# EAGLE design flood_sensor (EAGLE 9.5.2)
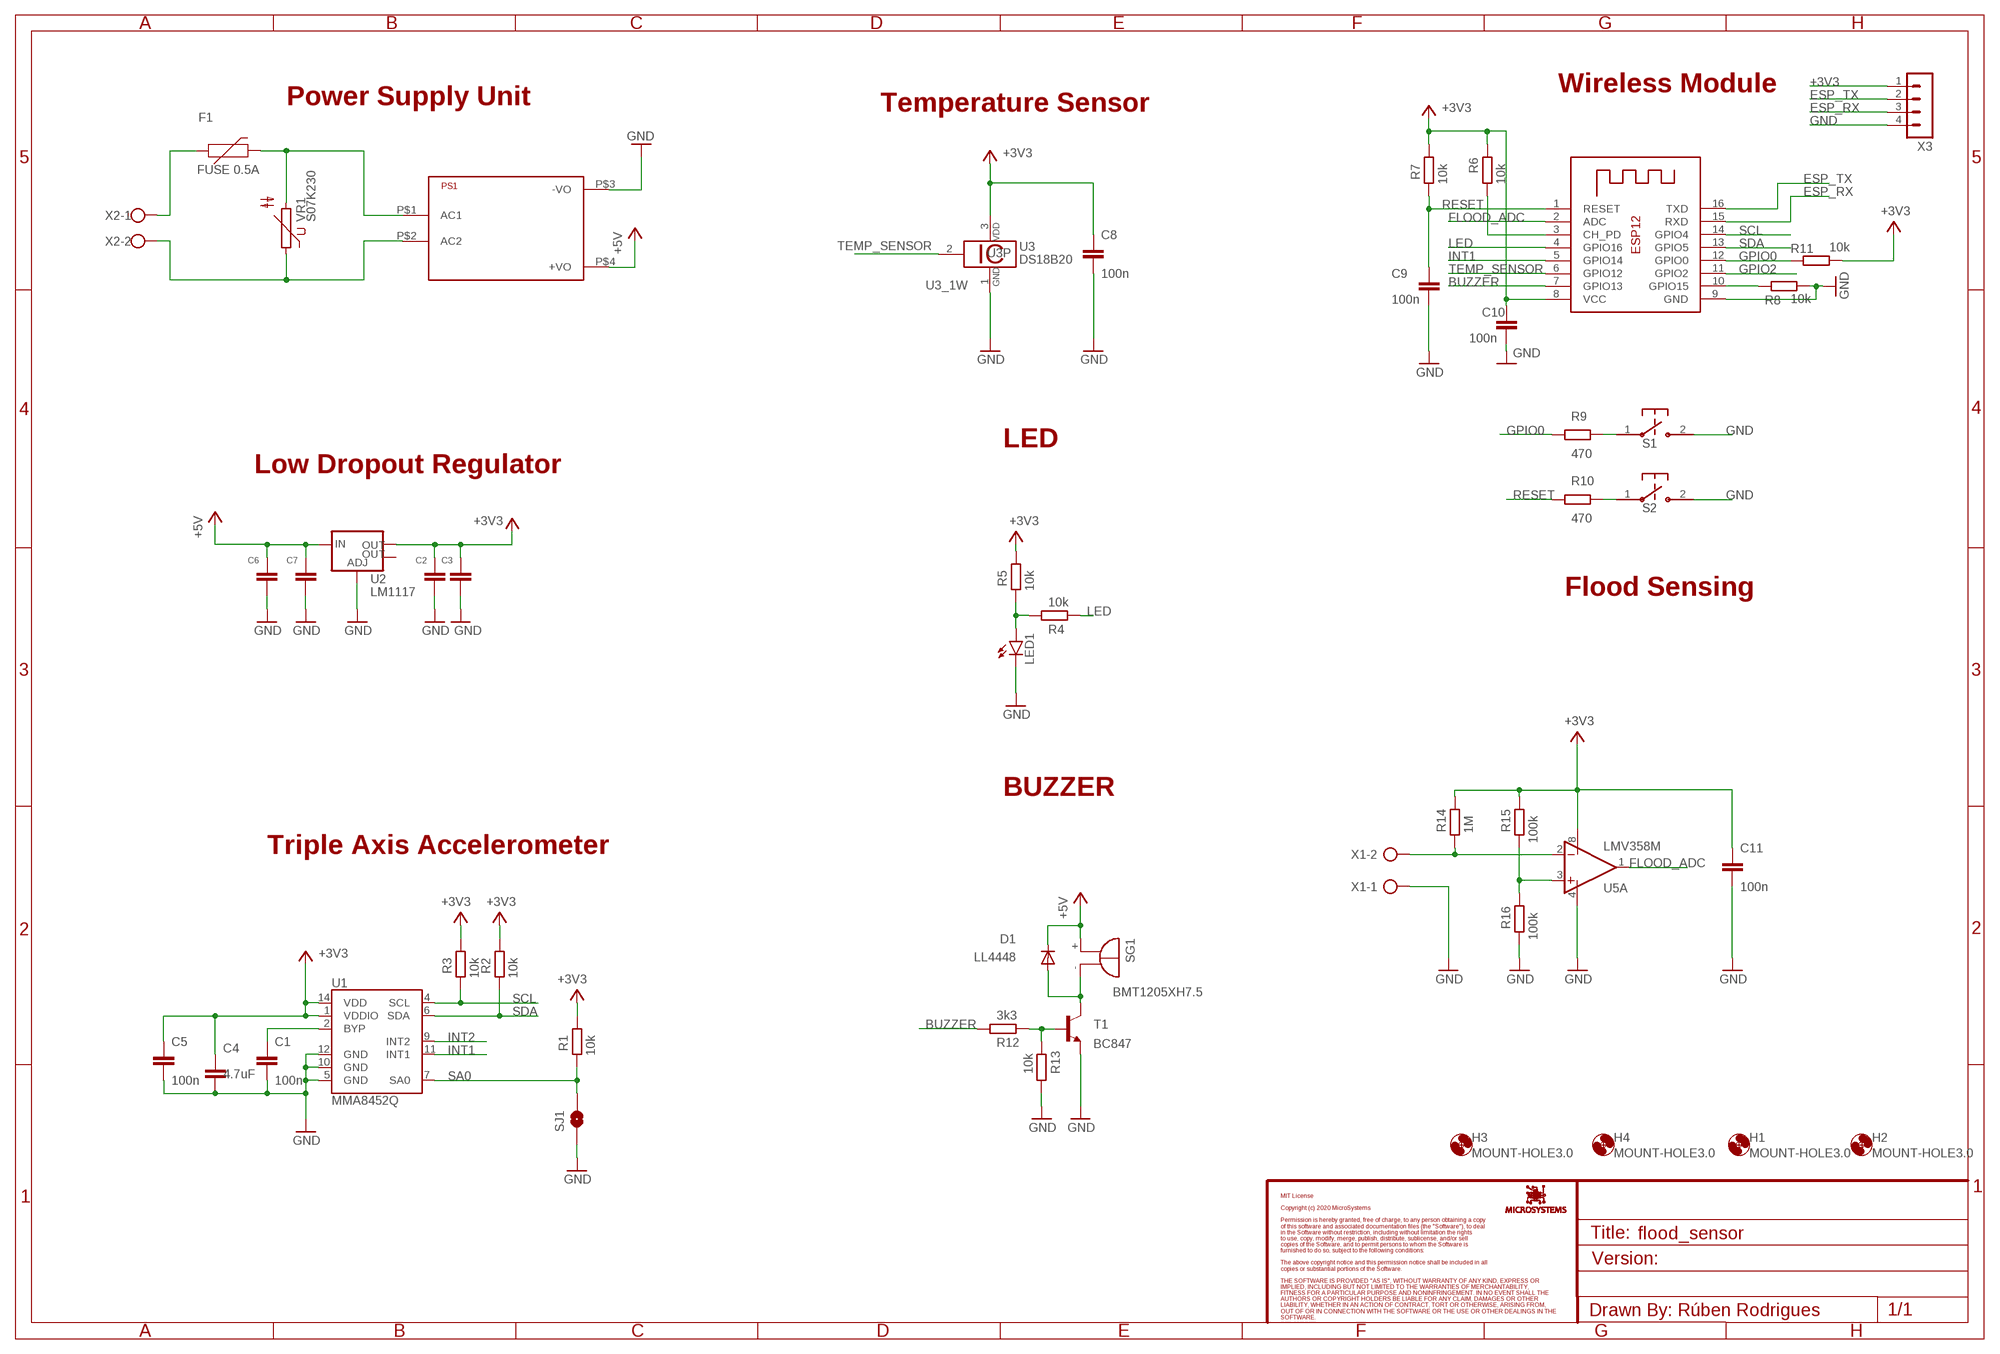
[diagram p0: schematic, sheet 1]

## Parts
C1  100n  C-EUC0805  [C0805]
C2  100uF  C-EUC1206  [C1206]
C3  22uF  C-EUC1206  [C1206]
C4  4.7uF  C-EUC0805  [C0805]
C5  100n  C-EUC0805  [C0805]
C6  22uF  C-EUC1206  [C1206]
C7  100uF  C-EUC1206  [C1206]
C8  100n  C-EUC0805  [C0805]
C9  100n  C-EUC0805  [C0805]
C10  100n  C-EUC0805  [C0805]
C11  100n  C-EUC0805  [C0805]
D1  LL4448  DIODE-SOD80C  [SOD80C]
F1  FUSE 0.5A  PPTC_PTH  [PTH]
H1  MOUNT-HOLE3.0  [3,0]
H2  MOUNT-HOLE3.0  [3,0]
H3  MOUNT-HOLE3.0  [3,0]
H4  MOUNT-HOLE3.0  [3,0]
LED1  LED3MM  [LED3MM]
PS1  HLK-PM013W  [HLK-PM01]
R1  10k  R-EU_R0805  [R0805]
R2  10k  R-EU_R0805  [R0805]
R3  10k  R-EU_R0805  [R0805]
R4  10k  R-EU_R0805  [R0805]
R5  10k  R-EU_R0805  [R0805]
R6  10k  R-EU_R0805  [R0805]
R7  10k  R-EU_R0805  [R0805]
R8  10k  R-EU_R0805  [R0805]
R9  470  R-EU_R0805  [R0805]
R10  470  R-EU_R0805  [R0805]
R11  10k  R-EU_R0805  [R0805]
R12  3k3  R-EU_R0805  [R0805]
R13  10k  R-EU_R0805  [R0805]
R14  1M  R-EU_R0805  [R0805]
R15  100k  R-EU_R0805  [R0805]
R16  100k  R-EU_R0805  [R0805]
S1  SWITCHES_B3U-1000P  [SWITCHES_B3U-1000P]
S2  SWITCHES_B3U-1000P  [SWITCHES_B3U-1000P]
SG1  BMT1205XH7.5  [BMT1205XH7.5]
SJ1  SOLDERJUMPERNO  [SJ_2S-NO]
T1  BC847  [SOT23]
U1  MMA8452Q  [QFN-16_0.5MM]
U2  LM1117  V_REG_LM1117SOT223  [SOT223]
U3  DS18B20  [TO92-]
U4  ESP-12  [ESP-12]
U5  LMV358M  [SO08]
VR1  S07K230  [S07K230]
X1  W237-102  [W237-102]
X2  W237-102  [W237-102]
X3  MA04-1  [MA04-1]

## Nets
+3V3: C2.1 C3.1 C4.1 C5.1 C8.1 C10.1 C11.1 R1.1 R2.1 R3.1 R5.1 R6.1 R7.1 R11.2 R14.1 R15.1 U1.1(VDDIO) U1.14(VDD) U2.2(OUT) U3.3 U4.8(VCC) U5.8(P:V+) X3.1
+5V: C6.1 C7.1 D1.C PS1.P$4(+VO) SG1.+ U2.3(IN)
BUZZER: R12.1 U4.7(GPIO13)
BYP: C1.1 U1.2(BYP)
ESP_RX: U4.15(RXD) X3.3
ESP_TX: U4.16(TXD) X3.2
FLOOD_ADC: U4.2(ADC) U5.1(A:OUT)
GND: C1.2 C2.2 C3.2 C4.2 C5.2 C6.2 C7.2 C8.2 C9.2 C10.2 C11.2 LED1.K(C) PS1.P$3(-VO) R8.2 R13.1 R16.2 S1.2 S2.2 SJ1.1 T1.2(E) U1.5(GND) U1.10(GND) U1.12(GND) U2.1(ADJ) U3.1 U4.9(GND) U5.4(P:V-) X1.1 X3.4
GPIO0: R9.1 R11.1 U4.12(GPIO0)
GPIO2: U4.11(GPIO2)
INT1: U1.11(INT1) U4.5(GPIO14)
INT2: U1.9(INT2)
LED: R4.2 U4.4(GPIO16)
N$1: R8.1 U4.10(GPIO15)
N$2: R15.2 R16.1 U5.3(A:+IN)
N$3: F1.P$1 X2.1
N$4: F1.P$2 PS1.P$1(AC1) VR1.2
N$5: PS1.P$2(AC2) VR1.1 X2.2
N$6: R9.2 S1.1
N$7: LED1.A R4.1 R5.2
N$8: R14.2 U5.2(A:-IN) X1.2
N$9: R10.2 S2.1
N$11: R6.2 U4.3(CH_PD)
N$12: D1.A SG1.- T1.3(C)
N$14: R12.2 R13.2 T1.1(B)
RESET: C9.1 R7.2 R10.1 U4.1(RESET)
SA0: R1.2 SJ1.2 U1.7(SA0)
SCL: R3.2 U1.4(SCL) U4.14(GPIO4)
SDA: R2.2 U1.6(SDA) U4.13(GPIO5)
TEMP_SENSOR: U3.2 U4.6(GPIO12)
Unconnected: U2.4(OUT) U5.5(B:+IN) U5.6(B:-IN) U5.7(B:OUT)

## Notes on the sheet
- Wireless Module
- Power Supply Unit | Temperature Sensor
- LED
- Low Dropout Regulator
- Flood Sensing
- BUZZER
- Triple Axis Accelerometer

## Library data of the parts
C1 C9 C10 = rcl:C-EU: CAPACITOR, European symbol
C2-C8 C11 = rcl:C-EU: CAPACITOR, European symbol; SPICEPREFIX: C
D1 = diode:DIODE-: DIODE
F1 = SparkFun-Fuses:PPTC: Resettable Fuse PPTC Resettable Fuse. Really a sort of resistor with a polymeric positive temperature coefficient whose resistance increases dramatically with an increase in temperature. When heated by the power passing through the resistance rises causing the current to be limited, protecting the circuit. This is achieved by the transition of the polymer from a crystalline to an amorphous state where the conductive carbon separates breaking the conductive pathways found in the cool crystalline structure. When a PPTC cools back down it resumes conducting letting the circuit turn back on. SparkFun Products: SparkFun RedBoard - Programmed with Arduino <https://www.sparkfun.com/products/12757> Pro Micro - 5V/16MHz <https://www.sparkfun.com/products/12640> Arduino Pro 328 - 5V/16MHz <https://www.sparkfun.com/products/10915> MP3 Trigger <https://www.sparkfun.com/products/13720>; PROD_ID: RES-08490; SERIE: 392; VALUE: 72V/0.25A
H1-H4 = holes:MOUNT-HOLE: MOUNTING HOLE with drill center marker
LED1 = led:LED: LED OSRAM: - CHIPLED LG R971, LG N971, LY N971, LG Q971, LY Q971, LO R971, LY R971 LH N974, LH R974 LS Q976, LO Q976, LY Q976 LO Q996 - Hyper CHIPLED LW Q18S LB Q993, LB Q99A, LB R99A - SideLED LS A670, LO A670, LY A670, LG A670, LP A670 LB A673, LV A673, LT A673, LW A673 LH A674 LY A675 LS A676, LA A676, LO A676, LY A676, LW A676 LS A679, LY A679, LG A679 - Hyper Micro SIDELED® LS Y876, LA Y876, LO Y876, LY Y876 LT Y87S - SmartLED LW L88C, LW L88S LB L89C, LB L89S, LG L890 LS L89K, LO L89K, LY L89K LS L896, LA L896, LO L896, LY L896 - TOPLED LS T670, LO T670, LY T670, LG T670, LP T670 LSG T670, LSP T670, LSY T670, LOP T670, LYG T670 LG T671, LOG T671, LSG T671 LB T673, LV T673, LT T673, LW T673 LH T674 LS T676, LA T676, LO T676, LY T676, LB T676, LH T676, LSB T676, LW T676 LB T67C, LV T67C, LT T67C, LS T67K, LO T67K, LY T67K, LW E67C LS E67B, LA E67B, LO E67B, LY E67B, LB E67C, LV E67C, LT E67C LW T67C LS T679, LY T679, LG T679 LS T770, LO T770, LY T770, LG T770, LP T770 LB T773, LV T773, LT T773, LW T773 LH T774 LS E675, LA E675, LY E675, LS T675 LS T776, LA T776, LO T776, LY T776, LB T776 LHGB T686 LT T68C, LB T68C - Hyper Mini TOPLED® LB M676 - Mini TOPLED Santana® LG M470 LS M47K, LO M47K, LY M47K Source: http://www.osram.convergy.de LUXEON: - LUMILED® LXK2-PW12-R00, LXK2-PW12-S00, LXK2-PW14-U00, LXK2-PW14-V00 LXK2-PM12-R00, LXK2-PM12-S00, LXK2-PM14-U00 LXK2-PE12-Q00, LXK2-PE12-R00, LXK2-PE12-S00, LXK2-PE14-T00, LXK2-PE14-U00 LXK2-PB12-K00, LXK2-PB12-L00, LXK2-PB12-M00, LXK2-PB14-N00, LXK2-PB14-P00, LXK2-PB14-Q00 LXK2-PR12-L00, LXK2-PR12-M00, LXK2-PR14-Q00, LXK2-PR14-R00 LXK2-PD12-Q00, LXK2-PD12-R00, LXK2-PD12-S00 LXK2-PH12-R00, LXK2-PH12-S00 LXK2-PL12-P00, LXK2-PL12-Q00, LXK2-PL12-R00 Source: www.luxeon.com KINGBRIGHT: KA-3528ASYC Source: www.kingbright.com
PS1 = ruben:HLK-PM01: Hi-Link Power Supply HLK-PM01 3W Author: Ahmed Said <https://github.com/AhmedSaid/EAGLELibraries>
R1-R16 = rcl:R-EU_: RESISTOR, European symbol; SPICEPREFIX: R
S1 S2 = ruben:SWITCHES_B3U: Switch; DIGIKEY: SW1020CT-ND; MANUFACTURER: Omron; MPN: B3U-1000P
SG1 = buzzer:BMT1205XH7.5: MAGNETIC TRANSDUCER Source: Http:www.be-star.com; OC_FARNELL: unknown; OC_NEWARK: unknown
SJ1 = SparkFun:SOLDERJUMPER: Solder Jumper Standard SMD solder jumper. Used to automate production. Two varients : Normally Open and Normally Closed are the same, but have different paste layers. NC will have a large amount of paste and should jumper during reflow.
T1 = transistor-neu-to92:BC847: NPN TRANSISTOR
U1 = ruben:MMA8452Q: MMA8452Q 3-Axis, 12/8-bit Digital Accelerometer Supply Voltage: 1.6-3.6V Range: +/- 2g, 4g, 8g Interface: I2C, 12-bit and 8-bit ODR: 1.56 Hz - 800 Hz Package: QFN-16 http://cache.freescale.com/files/sensors/doc/data_sheet/MMA8452Q.pdf
U2 = SparkFun-IC-Power:V_REG_LM1117: Voltage Regulator LM1117 Standard adjustable voltage regulator but in SMD form. Spark Fun Electronics SKU : COM-00595; PROD_ID: VREG-08170
U3 = 1wire:DS18B20: Programmable Resolution Digital Thermometer This chip provides a onewire thermosensor with approx. 0.5°C accuracy. A programmable over/undertemperure alarm is available. The precision can be set from 9..12 bits. Notes: Vdd must be applied for accurate measurements at low temperatures, as the parasite power circuit otherwise heats the sensor. If parasite power is used, Vdd has to be connected to GND. The DS1822 is a low-cost thermometer chip, the DS18S20 is similar to the DS18B20, but with 9 Bit precision only. Author: Jan Kandziora <jjj@gmx.de>
U4 = adafruit:ESP-12
U5 = linear:LMV358?*: Dual General Purpose, Low Voltage, Rail-to-Rail Output Operational Amplifiers Source: http://www.national.com/mpf/LM/LMV321.html http://www.national.com/dt/lmv_qual.pdf
VR1 = varistor:S07K230: VARISTOR
X1 X2 = con-wago-500:W237-102: WAGO SCREW CLAMP; MPN: 237-102; OC_FARNELL: unknown; OC_NEWARK: 70K9898
X3 = con-lstb:MA04-1: PIN HEADER; OC_FARNELL: unknown; OC_NEWARK: unknown

## Board
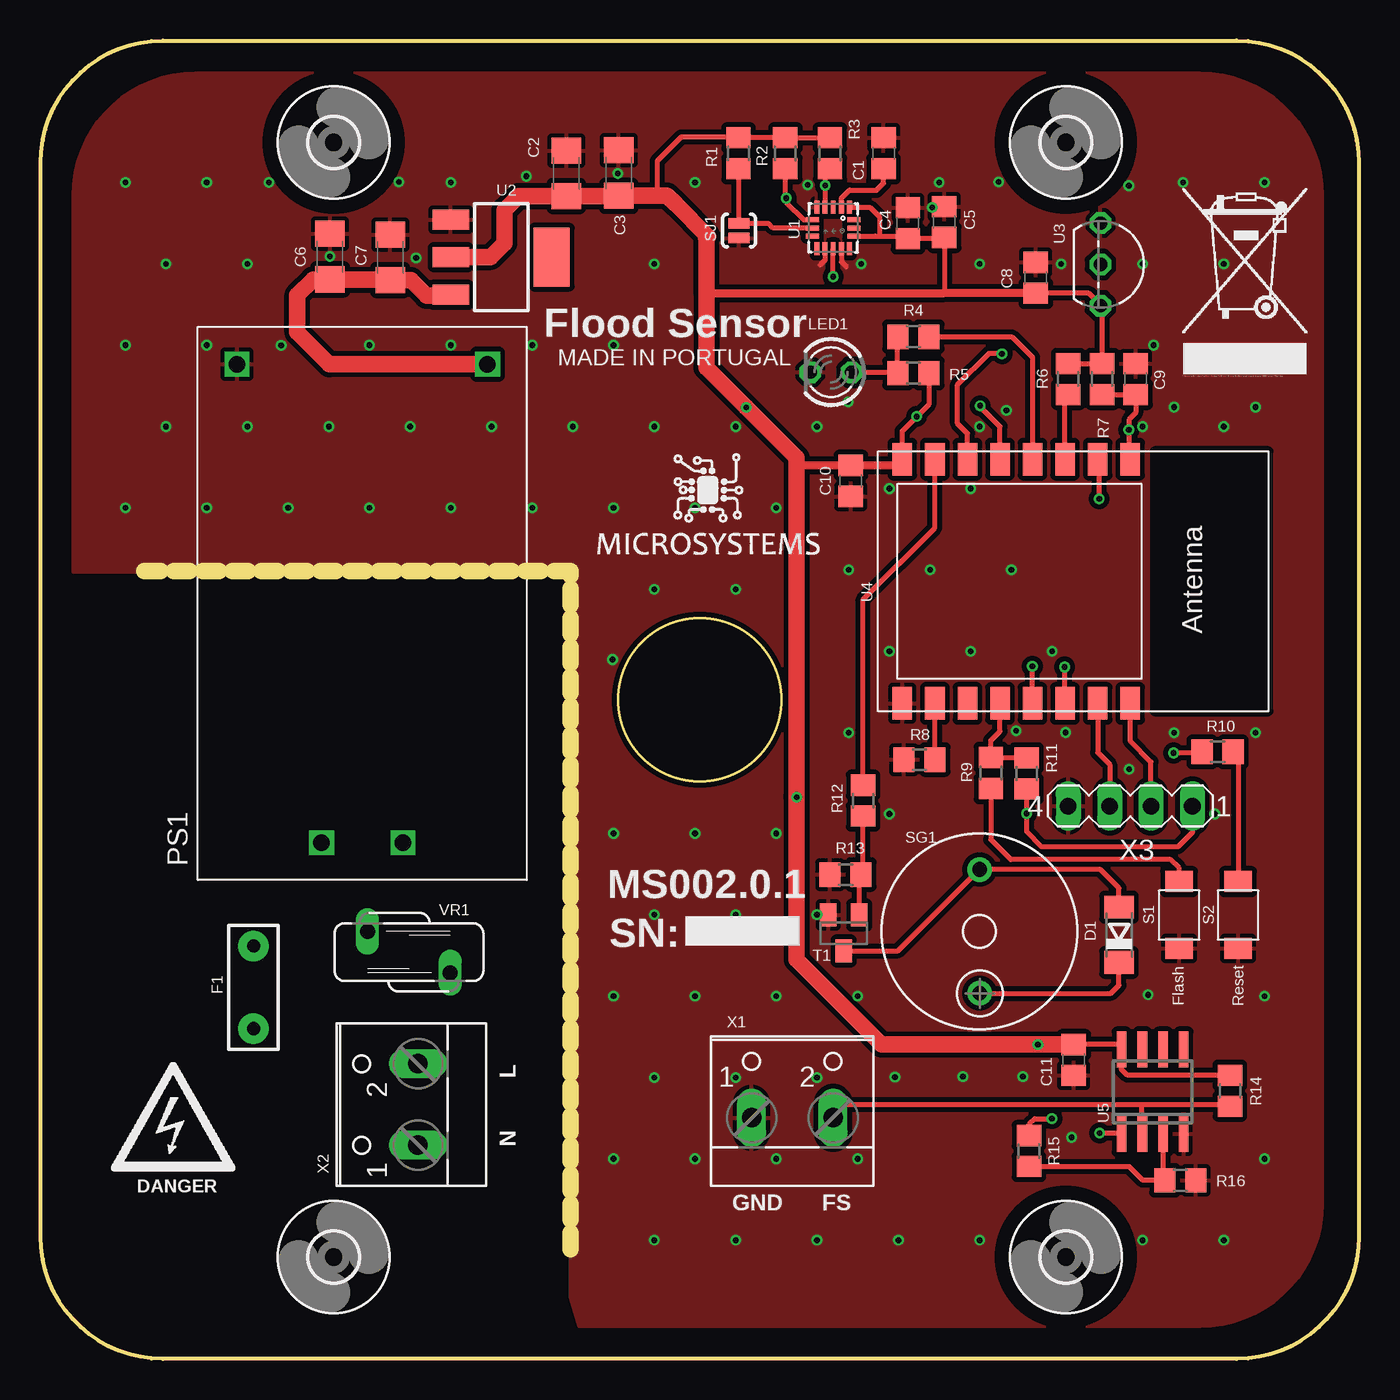
[diagram p1: board, top side]
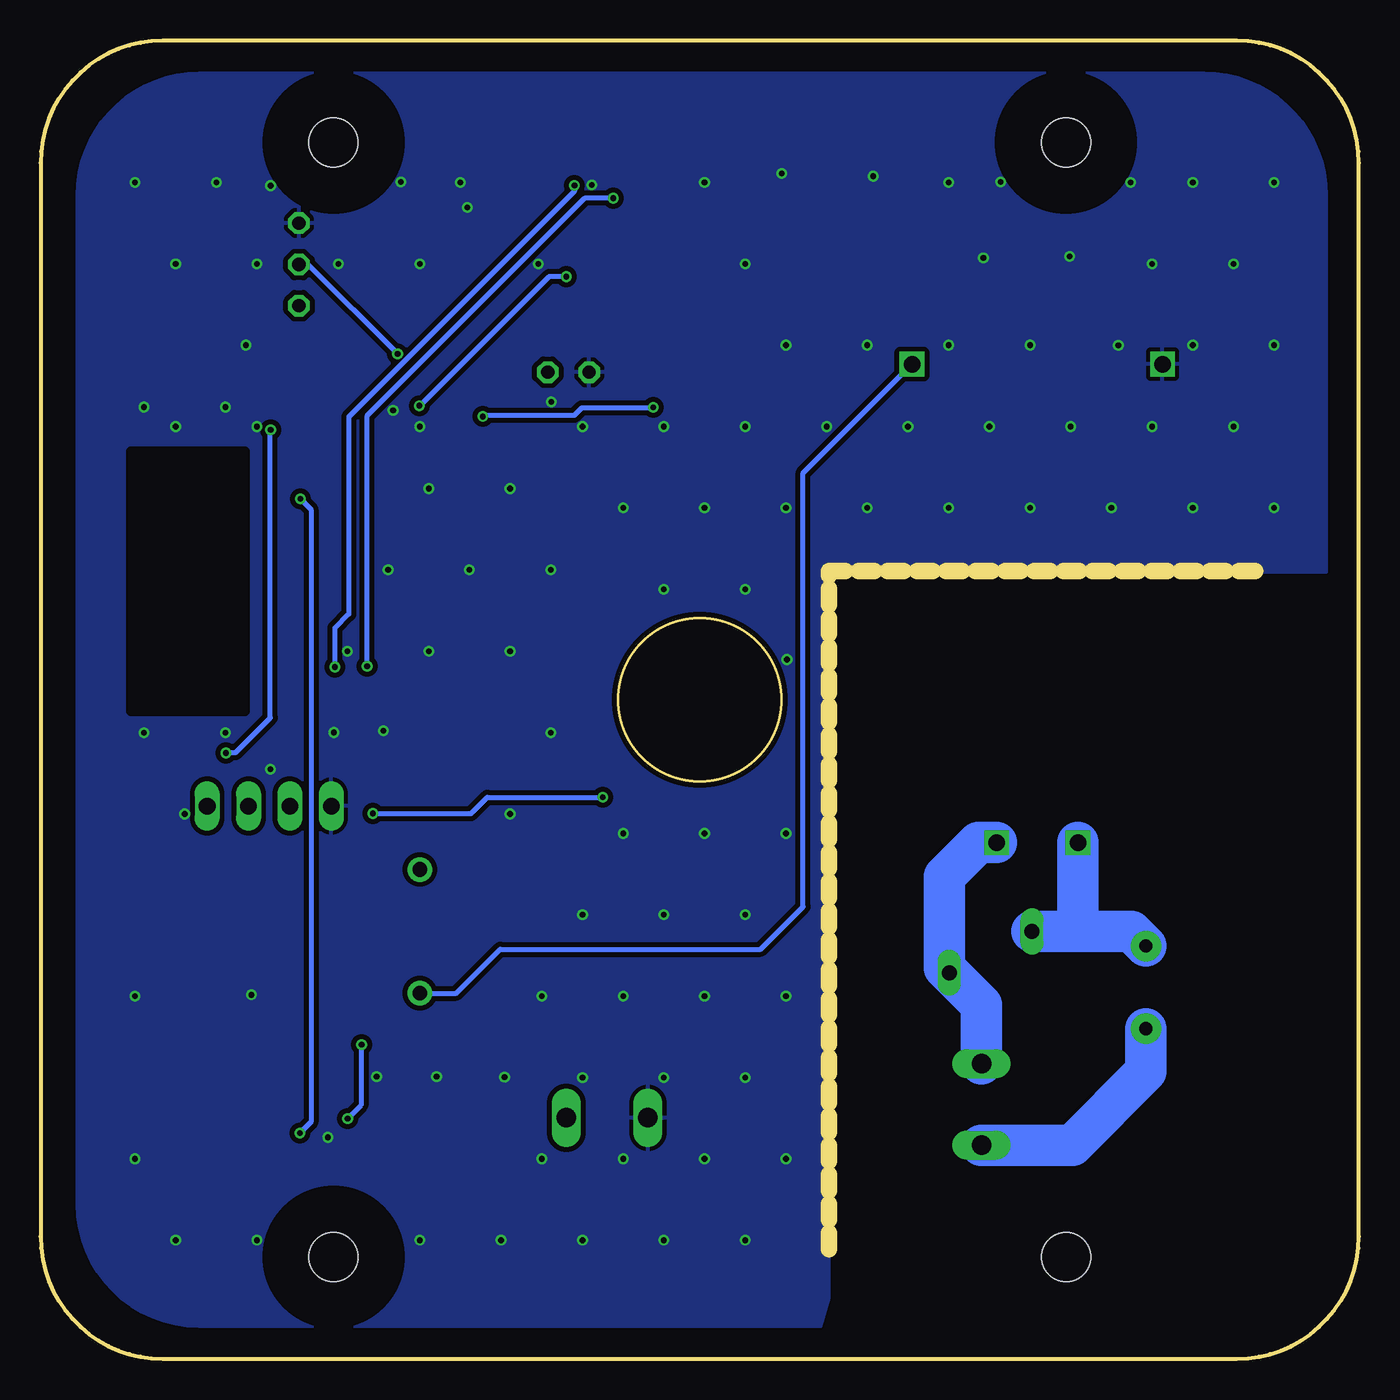
[diagram p2: board, bottom side, seen from below]

Size 81 x 81 mm. Coordinates in mm from the lower left corner, seen from the top.
Outline: 73.5,0 7.5,0 arc-90 0,7.5 0,73.5 arc-90 7.5,81 73.5,81 arc-90 81,73.5 81,7.5 arc-90 73.5,0
Outline: circle at 40.5,40.5 radius 5
Copper layers (1*16): Top 0.035mm / dielectric 1.5mm / Bottom 0.035mm
Design rules "SeeedStudio_2layer_DRU_no_angle_20140221 *": minimum track width 6mil, minimum drill 12mil, track to track 6mil, track to pad 6mil, pad to pad 6mil, via to via 6mil, smd to smd 0mil, copper to edge 10mil, drill to drill 10mil, minimum pad ring 10mil, minimum via ring 6mil, stop-mask expansion 2mil, vias tented up to drill 100mil, thermal gap 10mil
Milling: 39 lines

### Footprints (pad centres in the part's own frame; a part is rotated, then mirrored left to right if it is on the bottom)
C0805 = smd 1.3 x 1.5: 1 -0.95,0; 2 0.95,0
C1206 = smd 1.6 x 1.8: 1 -1.4,0; 2 1.4,0
SOD80C = smd 1.4 x 1.8: A 1.7,0; C -1.7,0
PTH = drill 0.8 pad 1.88: P$1 -2.54,0; P$2 2.54,0
3,0 = hole 3: 0,0
LED3MM = drill 0.813 octagon: A -1.27,0; K 1.27,0
HLK-PM01 = drill 1.016 square: P$1 -14.7,2.5; P$2 -14.7,-2.5; P$3 14.7,7.7; P$4 14.7,-7.7
R0805 = smd 1.3 x 1.5: 1 -0.95,0; 2 0.95,0
SWITCHES_B3U-1000P = smd 1.283 x 1.7: 1 -2.056,0; 2 2.056,0
BMT1205XH7.5 = drill 0.9 pad 1.5: + 3.8,0; - -3.8,0
SJ_2S-NO = smd 0.635 x 1.27: 1 -0.45,0; 2 0.45,0
SOT23 = smd 1 x 1.4: 1 -0.95,-1.1; 2 0.95,-1.1; 3 0,1.1
QFN-16_0.5MM = smd 0.8 x 0.3: 1 -1.275,1; 2 -1.275,0.5; 3 -1.275,0; 4 -1.275,-0.5; 5 -1.275,-1; 9 1.275,-1; 10 1.275,-0.5; 11 1.275,0; 12 1.275,0.5; 13 1.275,1 | smd 0.3 x 0.8: 6 -0.5,-1.275; 7 0,-1.275; 8 0.5,-1.275; 14 0.5,1.275; 15 0,1.275; 16 -0.5,1.275
SOT223 = smd 1.219 x 2.235: 1 -2.311,-3.099; 2 0,-3.099; 3 2.311,-3.099 | smd 3.6 x 2.2: 4 0,3.099
TO92- = drill 0.813 octagon: 1 -2.54,0; 2 0,0; 3 2.54,0
ESP-12 = smd 2 x 1.2: 1 -7.5,4.5; 2 -7.5,2.5; 3 -7.5,0.5; 4 -7.5,-1.5; 5 -7.5,-3.5; 6 -7.5,-5.5; 7 -7.5,-7.5; 8 -7.5,-9.5; 9 7.5,-9.5; 10 7.5,-7.5; 11 7.5,-5.5; 12 7.5,-3.5; 13 7.5,-1.5; 14 7.5,0.5; 15 7.5,2.5; 16 7.5,4.5
SO08 = smd 0.6 x 2.2: 1 -1.905,-2.6; 2 -0.635,-2.6; 3 0.635,-2.6; 4 1.905,-2.6; 5 1.905,2.6; 6 0.635,2.6; 7 -0.635,2.6; 8 -1.905,2.6
S07K230 = drill 0.914 long: 1 -1.27,-2.54; 2 1.27,2.54
W237-102 = drill 1.194 long: 1 -2.5,-1.27; 2 2.5,-1.27
MA04-1 = drill 1.016 long: 1 -3.81,0; 2 -1.27,0; 3 1.27,0; 4 3.81,0

### Placement (x,y rotation side)
C1  51.79,74.08 90 top
C2  32.3,72.85 90 top
C3  35.52,72.87 90 top
C4  53.29,69.78 90 top
C5  55.53,69.86 90 top
C6  17.78,67.73 90 top
C7  21.48,67.69 90 top
C8  61.15,66.43 90 top
C9  67.29,60.21 90 top
C10  49.78,53.95 270 top
C11  63.48,18.36 270 top
D1  66.26,26.06 90 top
F1  13.08,22.83 90 top
H1  18,74.75 0 top
H2  63,74.75 0 top
H3  18,6.25 0 top
H4  63,6.25 0 top
LED1  48.57,60.63 180 top
PS1  19.76,46.42 90 top
R1  42.88,74.08 270 top
R2  45.76,74.08 270 top
R3  48.5,74.08 270 top
R4  53.63,62.81 0 top
R5  53.63,60.57 180 top
R6  63.14,60.21 270 top
R7  65.23,60.21 270 top
R8  54,36.82 180 top
R9  58.39,36 270 top
R10  72.32,37.3 0 top
R11  60.58,35.97 270 top
R12  50.54,34.3 270 top
R13  49.46,29.76 0 top
R14  73.08,16.47 270 top
R15  60.73,12.77 270 top
R16  70.03,10.97 0 top
S1  69.96,27.27 270 top
S2  73.58,27.27 270 top
SG1  57.69,26.27 270 top
SJ1  42.91,69.33 90 top
T1  49.35,26.17 180 top
U1  48.7,69.49 270 top
U2  28.3,67.7 270 top
U3  65.13,67.25 270 top
U4  62.45,47.78 270 top
U5  68.33,16.41 0 top
U$1  [DISPOSAL]  70.16,60.54 0 top
U$2  [LOGO]  40.8,51.5 0 top
U$3  [HIGH-VOLTAGE]  4.35,11.08 0 top
VR1  22.63,24.99 90 top
X1  46.19,16.08 0 top
X2  21.92,15.63 90 top
X3  66.96,33.97 180 top

### Tracks (layer width: path | path; a pad name or v marks a point on that pad's centre or on a via)
+3V3  (via drill 0.35)
  Top 0.152: U5.8 66.24,19.19 66.24,19.31
  Top 0.3: 66.24,19.31 C11.1 | R14.1 66.78,17.42 66.41,17.79 U5.8 | R15.1 60.73,14.4 61.09,14.76 v62.14,14.76 | C8.1 64.4,65.48 64.99,64.89 64.99,64.85 U3.3 65.23,64.61 R7.1 R6.1 | 40.89,68.86 41,68.97 | U1.14 51.29,68.99 51.53,68.99 51.53,70.18 50.95,70.77 U1.1 | 37.88,73.6 39.36,75.08 42.83,75.08 R1.1 R2.1 R3.1 | U4.8 52.95,57.02 v53.84,57.91 54.58,58.65 R5.1 | 46.45,55.25 46.45,55.38 | R11.2 v60.58,33.52 v60.59,33.51 60.59,32.4 61.52,31.47 69.88,31.47 70.77,32.36 X3.1 | C5.1 55.53,65.51 55.52,65.5
  Top 0.305: 37.88,73.6 37.88,71.6 38.01,71.47 | 51.29,68.99 53.13,68.99 C4.1 55.45,68.83 C5.1
  Top 0.5: 40.91,65.5 55.52,65.5 61.13,65.5 C8.1 | U4.8 52.56,54.89 C10.1 46.78,54.9 46.44,55.24
  Top 1: U2.2 27.65,67.7 28.5,68.55 28.5,70.59 | C11.1 v61.28,19.31 51.67,19.31 46.45,24.53 v46.45,34.52 v46.44,34.53 46.44,55.24 46.45,55.25 | 46.45,55.38 v43.35,58.48 40.91,60.92 40.91,65.5 40.91,68.84 40.89,68.86 | 35.64,71.59 C3.1 | 39.03,70.94 41,68.97
  Top 1.016: 28.5,70.59 29.36,71.45 C2.1 35.5,71.45 35.64,71.59 | C3.1 38.01,71.47 38.5,71.47 39.03,70.94
  Bottom 0.3: v62.14,14.76 61.31,15.59 61.31,19.28 v61.28,19.31 | v60.59,33.51 54.55,33.51 53.57,34.5 46.47,34.5 v46.45,34.52 | v43.35,58.48 43.38,58.45 47.74,58.45 48.2,57.99 53.75,57.99 v53.84,57.91
+5V
  Top 0.3: SG1.+ 65.77,22.47 66.26,22.96 D1.C
  Top 1: PS1.P$4 17.73,61.12 15.76,63.09 15.76,65.36 16.73,66.33 C6.1 21.44,66.33 C7.1 22.75,66.29 23.71,65.33 25.14,65.33 U2.3
  Bottom 0.3: SG1.+ 55.46,22.47 52.77,25.16 36.76,25.16 34.15,27.77 34.15,54.43 PS1.P$4
BUZZER
  Top 0.3: R12.1 50.54,46.65 54.95,51.06 U4.7
BYP
  Top 0.3: U1.2 49.2,71.31 49.71,71.82 51.36,71.82 51.37,71.81 51.8,72.24 C1.1
ESP_RX
  Top 0.3: U4.15 64.95,37.25 65.69,36.51 X3.3
ESP_TX
  Top 0.3: X3.2 68.23,36.69 66.95,37.97 U4.16
FLOOD_ADC  (via drill 0.35)
  Top 0.3: v65.08,13.87 65.14,13.87 65.15,13.86 66.38,13.86 U5.1 | v65.05,52.85 65.05,55.18 U4.2
  Bottom 0.3: v65.05,52.85 64.39,52.19 64.39,14.56 v65.08,13.87
GND  (via drill 0.35)
  Top 0.3: U1.10 48.2,67.52 47.91,67.23 | U1.12 49.2,67.41 49.51,67.1
  other vias: 5.21,52.29 7.71,57.29 5.21,62.29 7.71,67.29 5.21,72.29 10.21,52.29 12.71,57.29 10.21,62.29 12.71,67.29 10.21,72.29 15.21,52.29 17.71,57.29 14.78,62.28 17.78,67.75 14.02,72.29 20.21,52.29 22.71,57.29 20.21,62.29 23.07,67.65 22.02,72.32 25.21,52.29 27.71,57.29 25.21,62.29 25.21,72.29 30.21,52.29 32.71,57.29 30.21,62.29 29.85,72.67 37.71,7.29 35.21,12.29 37.71,17.29 35.21,22.29 37.71,27.29 35.21,32.29 35.15,42.97 37.71,47.29 35.21,52.29 37.71,57.29 35.21,62.29 37.71,67.29 35.47,72.84 42.71,7.29 40.21,12.29 42.71,17.29 40.21,22.29 42.71,27.29 40.21,32.29 42.71,47.29 40.21,52.29 42.71,57.29 40.21,72.29 47.71,7.29 45.21,12.29 47.71,17.29 45.21,22.29 47.71,27.29 45.21,32.29 45.21,52.29 47.71,57.29 52.71,7.29 50.21,12.29 50.21,22.29 52.16,33.48 49.66,38.48 52.16,43.48 49.66,48.48 52.16,53.48 49.63,58.8 50.42,67.29 54.79,70.76 57.71,7.29 57.16,43.48 54.66,48.48 57.16,53.48 57.71,57.29 57.71,67.29 55.21,72.29 63.36,13.61 59.95,38.6 62.16,43.48 59.66,48.48 59.35,58.29 62.71,67.29 58.87,72.32 67.71,7.29 66.89,36.23 62.98,38.49 67.71,57.29 67.71,67.29 66.87,72.09 72.71,7.29 68.05,22.37 72.16,33.48 69.66,38.48 69.66,58.48 72.71,57.29 68.39,62.29 72.71,67.29 70.21,72.29 75.21,12.29 75.21,22.29 74.66,38.48 74.66,58.48 75.21,72.29 47.13,72.14 52.5,17.32 56.68,17.35 60.36,17.35
  pour Bottom (isolate 0.305): 2,48.34 2,71.5 arc-90 9.5,79 71.25,79 arc-90 78.75,71.5 78.75,9.5 arc-90 71.25,2 33.07,1.98 32.55,3.75 32.55,48.34
  pour Top (isolate 0.305): 2,48.34 2,71.5 arc-90 9.5,79 71.25,79 arc-90 78.75,71.5 78.75,9.5 arc-90 71.25,2 33.07,2 32.55,3.75 32.55,48.34
GPIO0
  Top 0.3: R9.1 58.39,37 | 58.39,37 58.39,38 58.95,38.56 U4.12 | R11.1 58.47,36.92 58.39,37
INT1  (via drill 0.35)
  Top 0.3: U4.5 58.95,57.29 57.73,58.51 v57.73,58.57 | v48.7,66.5 U1.11
  Bottom 0.3: v57.73,58.57 57.69,58.57 49.76,66.5 v48.7,66.5
LED
  Top 0.3: R4.2 59.68,62.81 60.95,61.54 U4.4
N$1
  Top 0.3: R8.1 U4.10
N$2
  Top 0.3: R15.2 66.87,11.82 67.72,10.97 R16.1 68.95,11.09 68.97,11.11 U5.3
N$3
  Bottom 2.54: X2.1 17.61,13.13 13.08,17.66 F1.P$1
N$4
  Bottom 2.54: F1.P$2 13.97,26.26 17.3,26.26 | 17.3,26.26 VR1.2 | PS1.P$1 17.26,26.3 17.3,26.26
N$5
  Bottom 2.54: X2.2 23.19,21.74 VR1.1 25.48,24.03 25.48,29.63 23.39,31.72 PS1.P$2
N$6
  Top 0.3: R9.2 58.39,31.91 59.61,30.69 69.43,30.69 69.96,30.16 S1.1
N$7
  Top 0.3: R5.2 52.68,60.63 52.66,60.63 | 52.66,60.63 52.66,62.79 R4.1 | LED1.A 52.66,60.63
N$8
  Top 0.3: 67.67,15.62 72.98,15.62 R14.2 | 67.67,15.62 49.5,15.62 X1.2 | 67.67,15.62 67.67,14.45 67.67,13.92 67.67,13.84 U5.2
N$9
  Top 0.3: R10.2 73.58,36.99 S2.1
N$11
  Top 0.3: U4.3 62.95,59.07 R6.2
N$12
  Top 0.3: T1.3 52.69,25.07 SG1.- 65.12,30.07 66.26,28.93 D1.A
N$14
  Top 0.3: R12.2 50.54,29.89 R13.2 50.3,29.65 T1.1
RESET  (via drill 0.35)
  Top 0.3: U4.1 66.87,55.36 v66.87,57.09 66.87,57.71 67.29,58.13 67.29,58.94 | C9.1 67.29,58.94 | R7.2 66.97,59.26 67.29,58.94 | R10.1 71.3,37.23 v69.61,37.23
  Bottom 0.3: v69.61,37.23 69.59,37.25 69.02,37.25 66.89,39.38 66.89,57.01 66.92,57.04 v66.87,57.09
SA0
  Top 0.3: U1.7 45.01,69.49 44.72,69.78 SJ1.2 42.88,69.81 R1.2
SCL  (via drill 0.35)
  Top 0.3: U1.4 v48.2,72.1 48.2,72.83 R3.2 | U4.14 62.95,42.5 v62.93,42.52 v62.92,42.51
  Bottom 0.3: v62.92,42.51 62.92,44.91 62.07,45.76 62.07,57.87 48.2,71.74 v48.2,72.1
SDA  (via drill 0.35)
  Top 0.3: U1.6 46.9,69.99 45.81,71.08 v45.81,71.32 45.76,71.37 R2.2 | U4.13 60.95,42.48 60.96,42.49 60.96,42.53 v60.94,42.55
  Bottom 0.3: v60.94,42.55 60.94,57.97 47.59,71.32 v45.81,71.32
TEMP_SENSOR  (via drill 0.35)
  Top 0.3: U4.6 56.95,56.86 56.34,57.47 56.34,59.86 58.26,61.78 59.05,61.78 v59.07,61.76
  Bottom 0.3: v59.07,61.76 64.56,67.25 U3.2

### Text on the board
tPlace: Flood Sensor | MADE IN PORTUGAL | MS002.0.1 | SN: | Flash | Reset | N L | GND FS